# EAGLE design quadrotor (EAGLE 7.7.0)
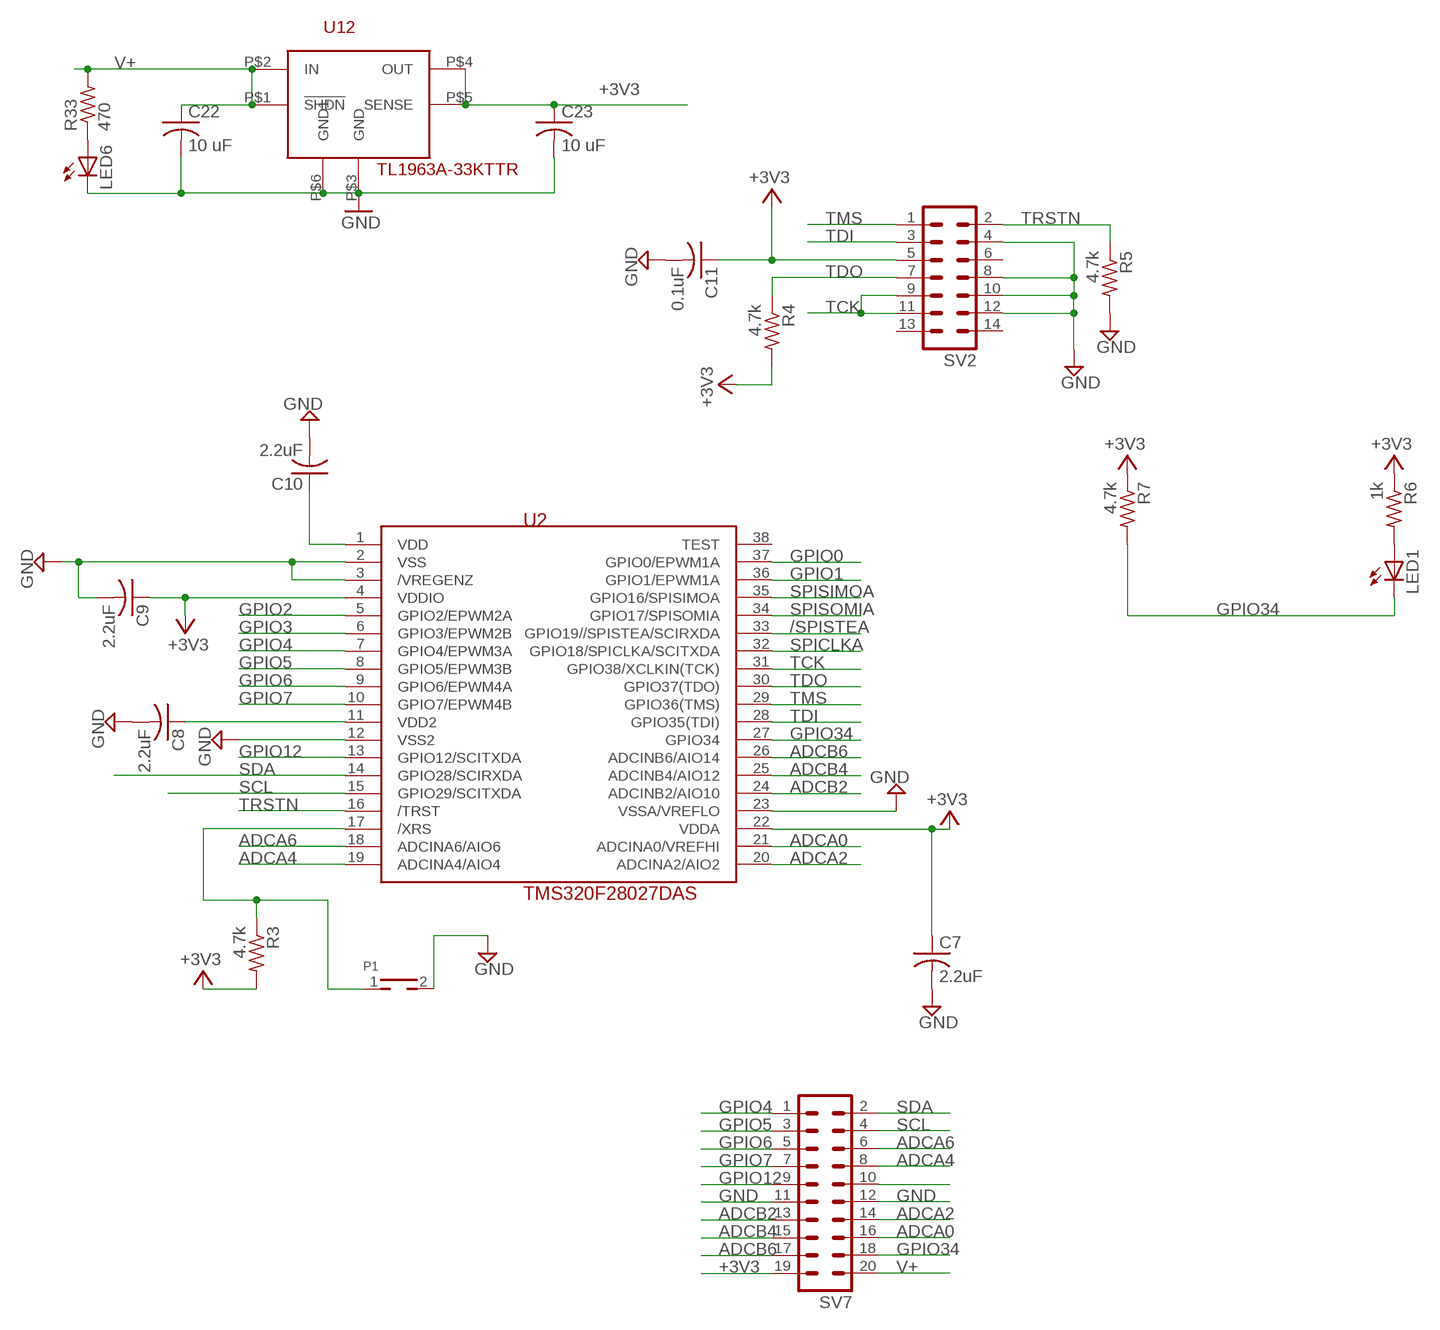
[diagram p0: schematic, sheet 1, part 1 of 2]
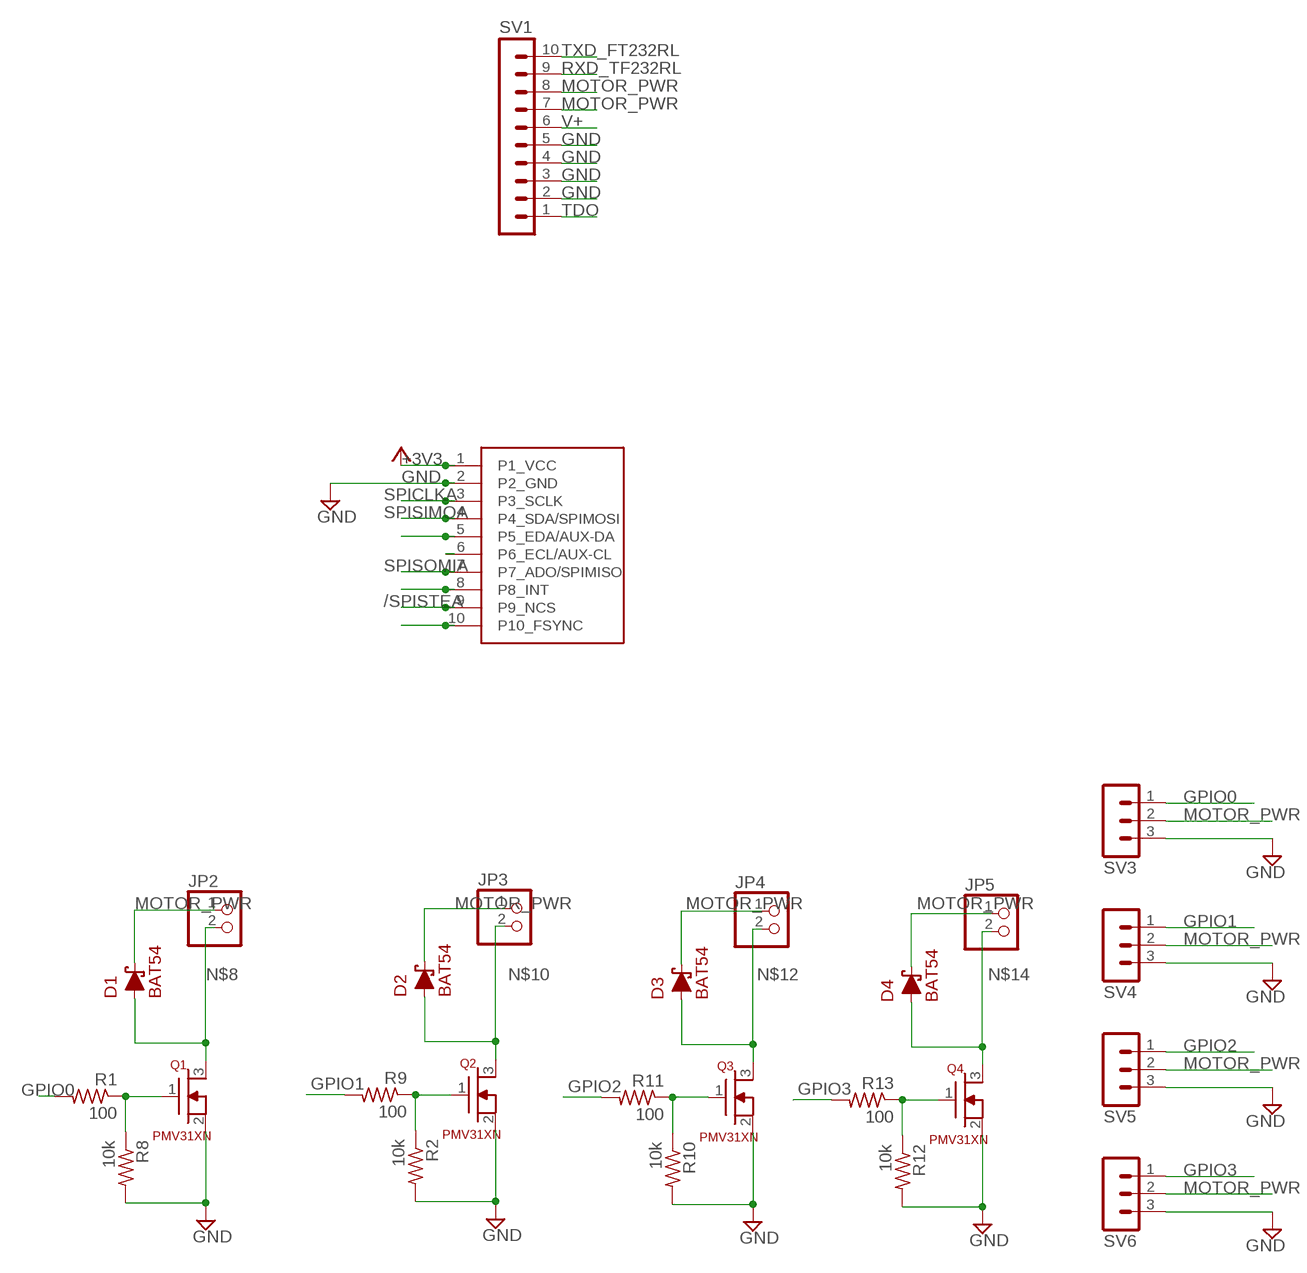
[diagram p1: schematic, sheet 1, part 2 of 2]

## Parts
C7  2.2uF  C-USC1206  [C1206]
C8  2.2uF  C-USC1206  [C1206]
C9  2.2uF  C-USC1206  [C1206]
C10  2.2uF  C-USC1206  [C1206]
C11  0.1uF  C-USC1206  [C1206]
C22  10 uF  C-USC1206  [C1206]
C23  10 uF  C-USC1206  [C1206]
D1  BAT54  [SOT23]
D2  BAT54  [SOT23]
D3  BAT54  [SOT23]
D4  BAT54  [SOT23]
JP2  PINHD-1X2  [1X02]
JP3  PINHD-1X2  [1X02]
JP4  PINHD-1X2  [1X02]
JP5  PINHD-1X2  [1X02]
LED1  LEDCHIPLED_1206  [CHIPLED_1206]
LED6  LEDCHIPLED_1206  [CHIPLED_1206]
P1  TH_PUSHBOTTON  [TH_PUSHBUTTON]
Q1  PMV31XN  [SOT23]
Q2  PMV31XN  [SOT23]
Q3  PMV31XN  [SOT23]
Q4  PMV31XN  [SOT23]
R1  100  R-US_R1206  [R1206]
R2  10k  R-US_R1206  [R1206]
R3  4.7k  R-US_R1206  [R1206]
R4  4.7k  R-US_R1206  [R1206]
R5  4.7k  R-US_R1206  [R1206]
R6  1k  R-US_R1206  [R1206]
R7  4.7k  R-US_R1206  [R1206]
R8  10k  R-US_R1206  [R1206]
R9  100  R-US_R1206  [R1206]
R10  10k  R-US_R1206  [R1206]
R11  100  R-US_R1206  [R1206]
R12  10k  R-US_R1206  [R1206]
R13  100  R-US_R1206  [R1206]
R33  470  R-US_M1206  [M1206]
SV1  MA10-1  [MA10-1]
SV2  MA07-2  [MA07-2]
SV3  MA03-1  [MA03-1]
SV4  MA03-1  [MA03-1]
SV5  MA03-1  [MA03-1]
SV6  MA03-1  [MA03-1]
SV7  MA10-2  [MA10-2]
U2  TMS320F28027DAS  [DA38]
U12  TL1963A-33KTTR  [TL1963AKTTR]
U$1  MPU-9250-BB  [MPU-9250-BB]

## Nets
+3V3 [supply]: C7.1 C9.1 C11.1 C23.1 R3.2 R4.2 R6.1 R7.1 SV2.5 SV7.19 U2.4(VDDIO) U2.22(VDDA) U12.P$4(OUT) U12.P$5(SENSE) U$1.1(P1_VCC)
/SPISTEA: U2.33(GPIO19//SPISTEA/SCIRXDA) U$1.9(P9_NCS)
ADCA0: SV7.16 U2.21(ADCINA0/VREFHI)
ADCA2: SV7.14 U2.20(ADCINA2/AIO2)
ADCA4: SV7.8 U2.19(ADCINA4/AIO4)
ADCA6: SV7.6 U2.18(ADCINA6/AIO6)
ADCB2: SV7.13 U2.24(ADCINB2/AIO10)
ADCB4: SV7.15 U2.25(ADCINB4/AIO12)
ADCB6: SV7.17 U2.26(ADCINB6/AIO14)
ASCL: U$1.6(P6_ECL/AUX-CL)
ASDA: U$1.5(P5_EDA/AUX-DA)
FSYNC: U$1.10(P10_FSYNC)
GND [supply]: C7.2 C8.2 C9.2 C10.2 C11.2 C22.2 C23.2 LED6.C P1.2 Q1.2(S) Q2.2(S) Q3.2(S) Q4.2(S) R2.2 R5.2 R8.2 R10.2 R12.2 SV1.2 SV1.3 SV1.4 SV1.5 SV2.4 SV2.8 SV2.10 SV2.12 SV3.3 SV4.3 SV5.3 SV6.3 SV7.11 SV7.12 U2.2(VSS) U2.3(/VREGENZ) U2.12(VSS2) U2.23(VSSA/VREFLO) U12.P$3(GND) U12.P$6(GND1) U$1.2(P2_GND)
GPIO0: R1.2 SV3.1 U2.37(GPIO0/EPWM1A)
GPIO1: R9.2 SV4.1 U2.36(GPIO1/EPWM1A)
GPIO2: R11.2 SV5.1 U2.5(GPIO2/EPWM2A)
GPIO3: R13.2 SV6.1 U2.6(GPIO3/EPWM2B)
GPIO4: SV7.1 U2.7(GPIO4/EPWM3A)
GPIO5: SV7.3 U2.8(GPIO5/EPWM3B)
GPIO6: SV7.5 U2.9(GPIO6/EPWM4A)
GPIO7: SV7.7 U2.10(GPIO7/EPWM4B)
GPIO12: SV7.9 U2.13(GPIO12/SCITXDA)
GPIO34: LED1.C R7.2 SV7.18 U2.27(GPIO34)
INT: U$1.8(P8_INT)
MOTOR_PWR [supply]: D1.3 D2.3 D3.3 D4.3 JP2.1 JP3.1 JP4.1 JP5.1 SV1.7 SV1.8 SV3.2 SV4.2 SV5.2 SV6.2
N$1: LED1.A R6.2
N$2: Q1.1(G) R1.1 R8.1
N$3: C8.1 U2.11(VDD2)
N$5: Q3.1(G) R10.1 R11.1
N$6: Q2.1(G) R2.1 R9.1
N$7: Q4.1(G) R12.1 R13.1
N$8 [supply]: D1.1 JP2.2 Q1.3(D)
N$10 [supply]: D2.1 JP3.2 Q2.3(D)
N$12 [supply]: D3.1 JP4.2 Q3.3(D)
N$14 [supply]: D4.1 JP5.2 Q4.3(D)
N$15: SV7.10
N$21: C10.1 U2.1(VDD)
N$35: P1.1 R3.1 U2.17(/XRS)
N$57: LED6.A R33.1
RXD_TF232RL: SV1.9
SCL: SV7.4 U2.15(GPIO29/SCITXDA)
SDA: SV7.2 U2.14(GPIO28/SCIRXDA)
SPICLKA: U2.32(GPIO18/SPICLKA/SCITXDA) U$1.3(P3_SCLK)
SPISIMOA: U2.35(GPIO16/SPISIMOA) U$1.4(P4_SDA/SPIMOSI)
SPISOMIA: U2.34(GPIO17/SPISOMIA) U$1.7(P7_ADO/SPIMISO)
TCK: SV2.9 SV2.11 U2.31(GPIO38/XCLKIN(TCK))
TDI: SV2.3 U2.28(GPIO35(TDI))
TDO: R4.1 SV1.1 SV2.7 U2.30(GPIO37(TDO))
TMS: SV2.1 U2.29(GPIO36(TMS))
TRSTN: R5.1 SV2.2 U2.16(/TRST)
TXD_FT232RL: SV1.10
V+ [supply]: C22.1 R33.2 SV1.6 SV7.20 U12.P$1(!SHDN) U12.P$2(IN)
Unconnected: SV2.6 SV2.13 SV2.14 U2.38(TEST)

## Library data of the parts
C7-C11 C22 C23 = rcl:C-US: CAPACITOR, American symbol
D1-D4 = SE423EagleLibrary:BAT54
JP2-JP5 = pinhead:PINHD-1X2: PIN HEADER
LED1 LED6 = led:LED: LED OSRAM: - CHIPLED LG R971, LG N971, LY N971, LG Q971, LY Q971, LO R971, LY R971 LH N974, LH R974 LS Q976, LO Q976, LY Q976 LO Q996 - Hyper CHIPLED LW Q18S LB Q993, LB Q99A, LB R99A - SideLED LS A670, LO A670, LY A670, LG A670, LP A670 LB A673, LV A673, LT A673, LW A673 LH A674 LY A675 LS A676, LA A676, LO A676, LY A676, LW A676 LS A679, LY A679, LG A679 - Hyper Micro SIDELED® LS Y876, LA Y876, LO Y876, LY Y876 LT Y87S - SmartLED LW L88C, LW L88S LB L89C, LB L89S, LG L890 LS L89K, LO L89K, LY L89K LS L896, LA L896, LO L896, LY L896 - TOPLED LS T670, LO T670, LY T670, LG T670, LP T670 LSG T670, LSP T670, LSY T670, LOP T670, LYG T670 LG T671, LOG T671, LSG T671 LB T673, LV T673, LT T673, LW T673 LH T674 LS T676, LA T676, LO T676, LY T676, LB T676, LH T676, LSB T676, LW T676 LB T67C, LV T67C, LT T67C, LS T67K, LO T67K, LY T67K, LW E67C LS E67B, LA E67B, LO E67B, LY E67B, LB E67C, LV E67C, LT E67C LW T67C LS T679, LY T679, LG T679 LS T770, LO T770, LY T770, LG T770, LP T770 LB T773, LV T773, LT T773, LW T773 LH T774 LS E675, LA E675, LY E675, LS T675 LS T776, LA T776, LO T776, LY T776, LB T776 LHGB T686 LT T68C, LB T68C - Hyper Mini TOPLED® LB M676 - Mini TOPLED Santana® LG M470 LS M47K, LO M47K, LY M47K Source: http://www.osram.convergy.de LUXEON: - LUMILED® LXK2-PW12-R00, LXK2-PW12-S00, LXK2-PW14-U00, LXK2-PW14-V00 LXK2-PM12-R00, LXK2-PM12-S00, LXK2-PM14-U00 LXK2-PE12-Q00, LXK2-PE12-R00, LXK2-PE12-S00, LXK2-PE14-T00, LXK2-PE14-U00 LXK2-PB12-K00, LXK2-PB12-L00, LXK2-PB12-M00, LXK2-PB14-N00, LXK2-PB14-P00, LXK2-PB14-Q00 LXK2-PR12-L00, LXK2-PR12-M00, LXK2-PR14-Q00, LXK2-PR14-R00 LXK2-PD12-Q00, LXK2-PD12-R00, LXK2-PD12-S00 LXK2-PH12-R00, LXK2-PH12-S00 LXK2-PL12-P00, LXK2-PL12-Q00, LXK2-PL12-R00 Source: www.luxeon.com KINGBRIGHT: KA-3528ASYC Source: www.kingbright.com
P1 = SE423EagleLibrary:TH_PUSHBOTTON
Q1-Q4 = SE423EagleLibrary:PMV31XN
R1-R13 R33 = rcl:R-US_: RESISTOR, American symbol
SV1 = con-lstb:MA10-1: PIN HEADER; OC_FARNELL: unknown; OC_NEWARK: unknown
SV2 = con-lstb:MA07-2: PIN HEADER; OC_FARNELL: unknown; OC_NEWARK: unknown
SV3-SV6 = con-lstb:MA03-1: PIN HEADER; OC_FARNELL: unknown; OC_NEWARK: unknown
SV7 = con-lstb:MA10-2: PIN HEADER; OC_FARNELL: unknown; OC_NEWARK: unknown
U2 = SE423EagleLibrary:TMS320F28027DAS
U12 = custom4:TL1963A-33KTTR
U$1 = MPU-9250_Breakoutboard:MPU-9250-BB

## Net classes
0 default: width 0.203 mm, drill 0.508 mm, clearance 0.203 mm
1 supply: width 0.61 mm, drill 0.508 mm, clearance 0.203 mm

## Board
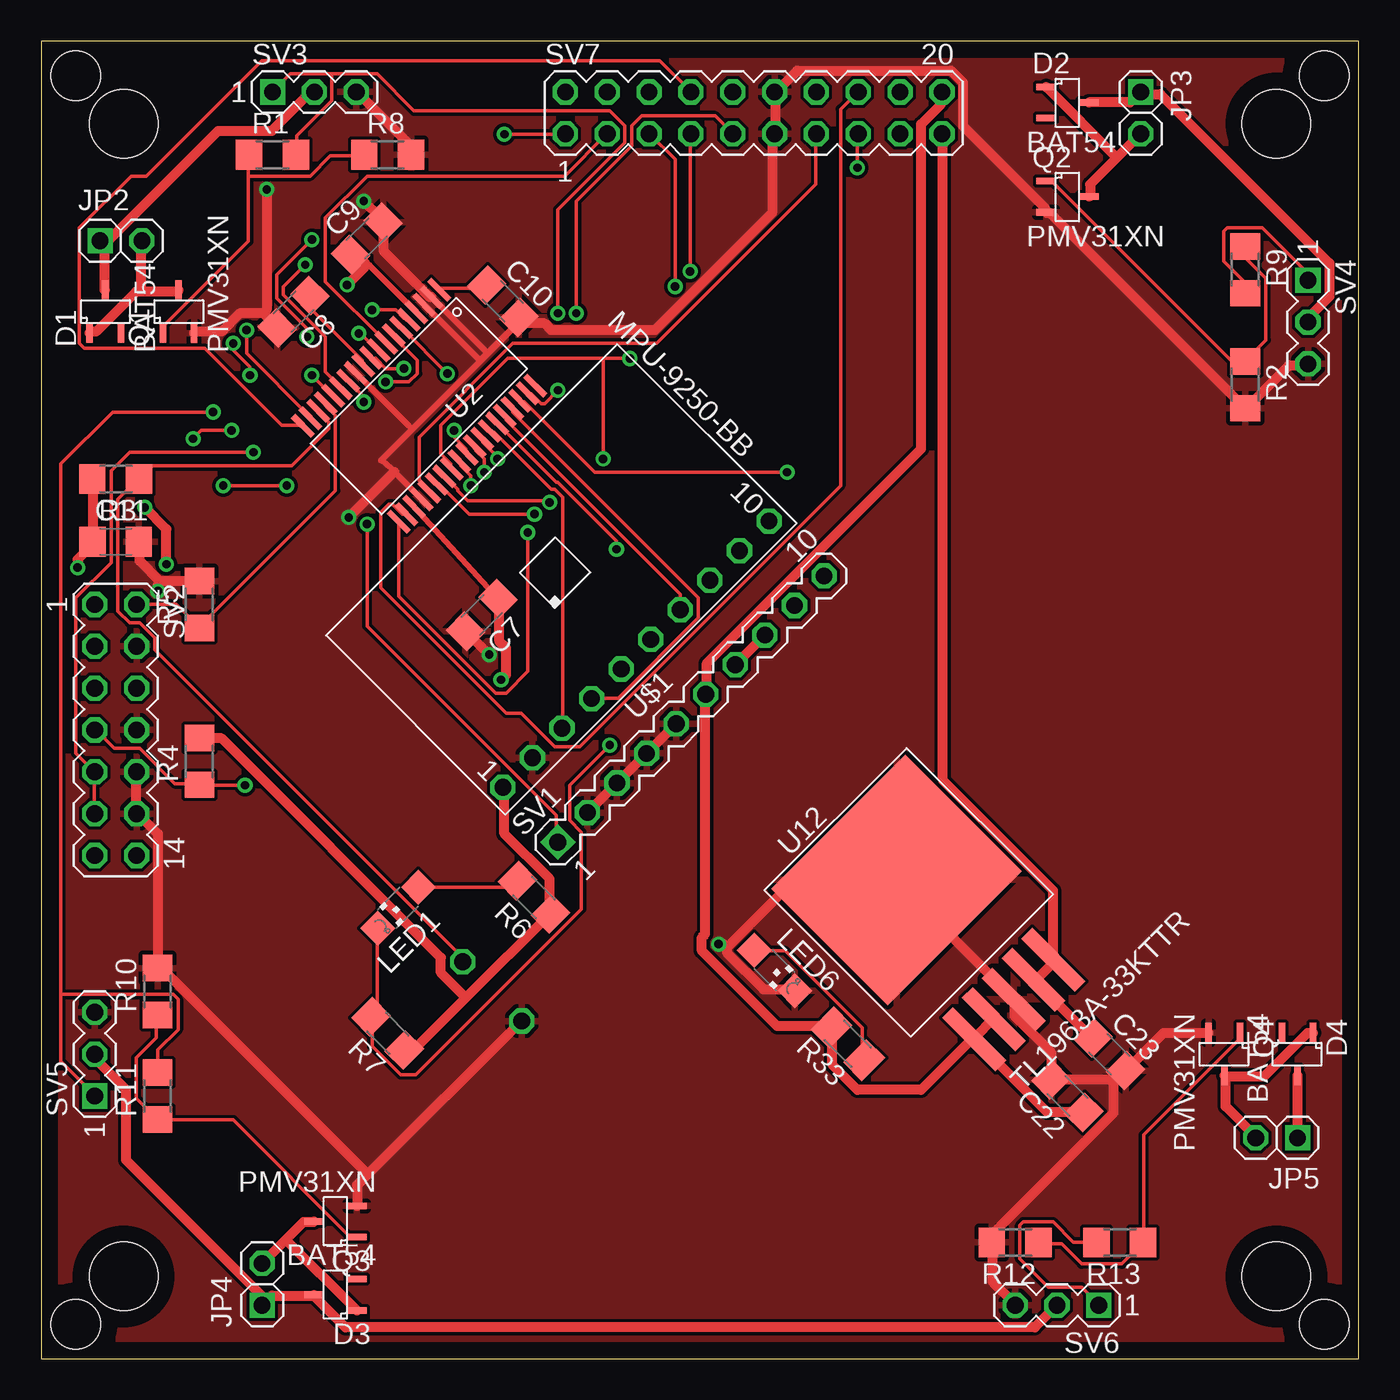
[diagram p2: board, top side]
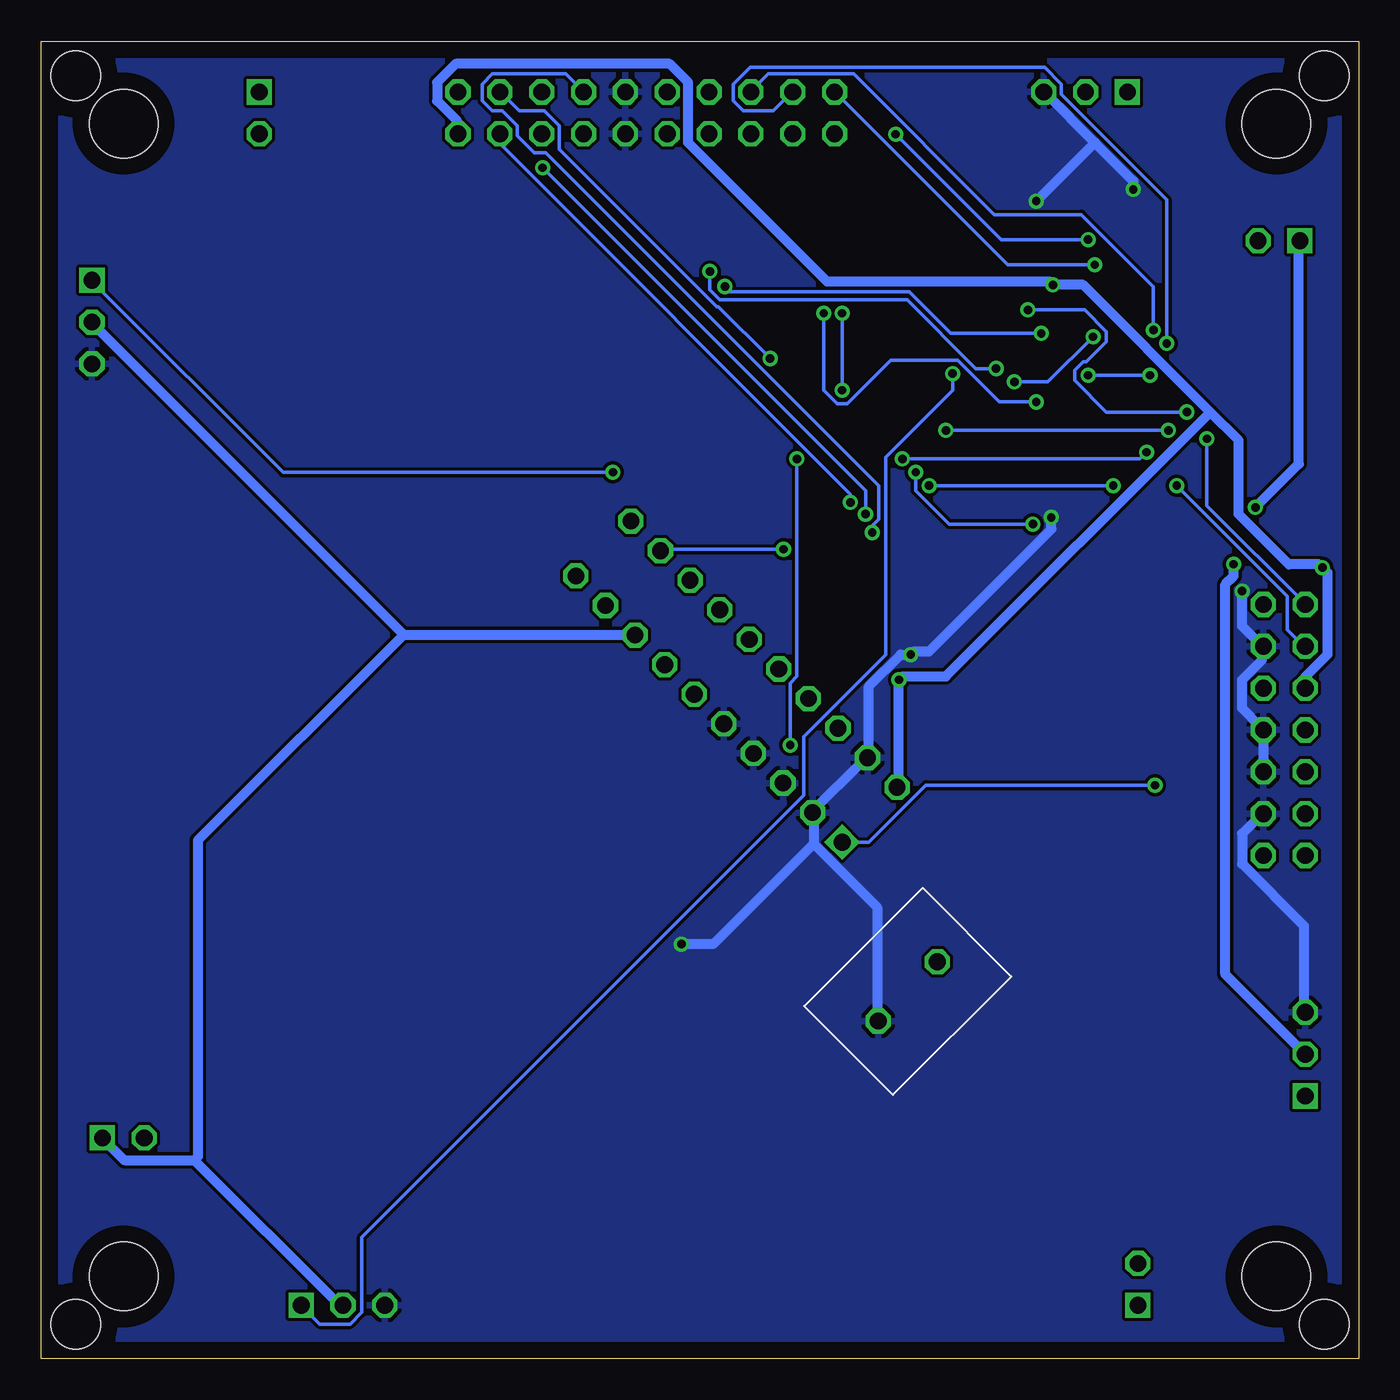
[diagram p3: board, bottom side, seen from below]

Size 80 x 80 mm. Coordinates in mm from the lower left corner, seen from the top.
Outline: 0,0 80,0 80,80 0,80 0,0
Copper layers (1*16): Top 0.035mm / dielectric 1.5mm / Bottom 0.035mm
Design rules "default *": minimum track width 8mil, minimum drill 20mil, track to track 8mil, track to pad 8mil, pad to pad 8mil, via to via 8mil, smd to smd 8mil, copper to edge 40mil, drill to drill 8mil, minimum pad ring 10mil, minimum via ring 8mil, stop-mask expansion 4mil, vias tented up to drill 0mil, thermal gap 10mil
Holes 3 mm at 2.1,77.9 77.9,77.9 77.9,2.1 2.1,2.1
Holes 4.15 mm at 5,75 75,75 75,5 5,5

### Footprints (pad centres in the part's own frame; a part is rotated, then mirrored left to right if it is on the bottom)
C1206 = smd 1.6 x 1.8: 1 -1.4,0; 2 1.4,0
SOT23 = smd 0.4 x 1.2: 1 -0.95,-1.3; 2 0.95,-1.3; 3 0,1.3
1X02 = drill 1.016 square: 1 -1.27,0 | drill 1.016 octagon: 2 1.27,0
CHIPLED_1206 = smd 1.5 x 1.5: A 0,-1.75; C 0,1.75
TH_PUSHBUTTON = drill 1.016 octagon: 1 0,2.54; 2 0,-2.54
R1206 = smd 1.6 x 1.803: 1 -1.422,0; 2 1.422,0
M1206 = smd 1.6 x 2: 1 -1.4,0; 2 1.4,0
MA10-1 = drill 1.016 square: 1 -11.43,0 | drill 1.016 octagon: 2 -8.89,0; 3 -6.35,0; 4 -3.81,0; 5 -1.27,0; 6 1.27,0; 7 3.81,0; 8 6.35,0; 9 8.89,0; 10 11.43,0
MA07-2 = drill 1.016 octagon: 1 -7.62,-1.27; 2 -7.62,1.27; 3 -5.08,-1.27; 4 -5.08,1.27; 5 -2.54,-1.27; 6 -2.54,1.27; 7 0,-1.27; 8 0,1.27; 9 2.54,-1.27; 10 2.54,1.27; 11 5.08,-1.27; 12 5.08,1.27; 13 7.62,-1.27; 14 7.62,1.27
MA03-1 = drill 1.016 square: 1 -2.54,0 | drill 1.016 octagon: 2 0,0; 3 2.54,0
MA10-2 = drill 1.016 octagon: 1 -11.43,-1.27; 2 -11.43,1.27; 3 -8.89,-1.27; 4 -8.89,1.27; 5 -6.35,-1.27; 6 -6.35,1.27; 7 -3.81,-1.27; 8 -3.81,1.27; 9 -1.27,-1.27; 10 -1.27,1.27; 11 1.27,-1.27; 12 1.27,1.27; 13 3.81,-1.27; 14 3.81,1.27; 15 6.35,-1.27; 16 6.35,1.27; 17 8.89,-1.27; 18 8.89,1.27; 19 11.43,-1.27; 20 11.43,1.27
DA38 = smd 0.35 x 1.705: 1 -5.85,-4.12; 2 -5.2,-4.12; 3 -4.55,-4.12; 4 -3.9,-4.12; 5 -3.25,-4.12; 6 -2.6,-4.12; 7 -1.95,-4.12; 8 -1.3,-4.12; 9 -0.65,-4.12; 10 0,-4.12; 11 0.65,-4.12; 12 1.3,-4.12; 13 1.95,-4.12; 14 2.6,-4.12; 15 3.25,-4.12; 16 3.9,-4.12; 17 4.55,-4.12; 18 5.2,-4.12; 19 5.85,-4.12; 20 5.85,4.12; 21 5.2,4.12; 22 4.55,4.12; 23 3.9,4.12; 24 3.25,4.12; 25 2.6,4.12; 26 1.95,4.12; 27 1.3,4.12; 28 0.65,4.12; 29 0,4.12; 30 -0.65,4.12; 31 -1.3,4.12; 32 -1.95,4.12; 33 -2.6,4.12; 34 -3.25,4.12; 35 -3.9,4.12; 36 -4.55,4.12; 37 -5.2,4.12; 38 -5.85,4.12
TL1963AKTTR = smd 0.914 x 4.572: P$1 -3.81,-10.16; P$2 -2.108,-10.16; P$3 -0.406,-10.16; P$4 1.295,-10.16; P$5 2.997,-10.16 | smd 11.5 x 10: P$6 -0.3,0
MPU-9250-BB = drill 1.016 octagon: 1 -11.434,-6.96; 2 -8.894,-6.96; 3 -6.354,-6.96; 4 -3.814,-6.96; 5 -1.274,-6.96; 6 1.266,-6.96; 7 3.806,-6.96; 8 6.346,-6.96; 9 8.886,-6.96; 10 11.426,-6.96

### Placement (x,y rotation side)
C7  26.75,45.16 225 top
C8  15.32,63.58 225 top
C9  19.77,68.03 45 top
C10  28.02,64.22 315 top
C11  4.53,49.61 0 top
C22  62.31,15.95 135 top
C23  64.85,18.5 315 top
D1  3.89,63.58 0 top
D2  62.31,76.28 270 top
D3  17.86,3.89 90 top
D4  76.28,18.5 180 top
JP2  4.85,67.89 0 top
JP3  66.75,75.64 270 top
JP4  13.41,4.53 90 top
JP5  75.01,13.41 180 top
LED1  21.67,27.38 135 top
LED6  44.53,23.57 225 top
P1  27.38,22.3 315 bottom
Q1  8.34,63.58 0 top
Q2  62.31,70.56 270 top
Q3  17.86,8.34 90 top
Q4  71.83,18.5 180 top
R1  14.05,73.11 0 top
R2  73.11,59.14 270 top
R3  4.53,53.42 180 top
R4  9.61,36.27 90 top
R5  9.61,45.8 90 top
R6  29.92,28.02 135 top
R7  21.04,19.77 135 top
R8  21.04,73.11 0 top
R9  73.11,66.12 270 top
R10  7.06,22.3 90 top
R11  7.06,15.95 90 top
R12  59.14,7.06 180 top
R13  65.48,7.06 180 top
R33  48.98,19.13 135 top
SV1  39.45,39.45 45 top
SV2  4.53,38.18 270 top
SV3  16.59,76.92 0 top
SV4  76.92,62.94 270 top
SV5  3.26,18.5 90 top
SV6  61.67,3.26 180 top
SV7  43.26,75.64 0 top
U2  22.94,57.87 225 top
U12  52.15,29.29 45 top
U$1  31.2,47.7 45 top

### Tracks (layer width: path | path; a pad name or v marks a point on that pad's centre or on a via)
+3V3  (via drill 0.51)
  Top 0.356: U2.22 C7.1 | U2.4 19.92,66.4 19.66,66.55 C9.1
  Top 0.61: C23.1 63.78,19.49 60.33,22.94 U12.P$4 60.53,23.14 61.34,23.96 U12.P$5 61.45,24.26 61.45,28.43 54.74,35.13 54.74,74.35 SV7.19 | R3.2 3.13,53.42 3.13,49.66 C11.1 3.03,49.36 2.21,48.54 v2.21,48.03 | v18.57,65.21 19.59,66.22 19.59,66.42 19.66,66.55 | 25.79,21.92 30.87,27 R6.1 30.87,27.31 30.87,29.14 28.12,31.88 28.12,34.62 U$1.1 | 25.79,21.92 22.64,18.77 22.13,18.77 R7.1 | 25.79,21.92 24.26,23.45 24.26,24.36 10.95,37.67 9.63,37.67 R4.2 | v27.92,41.23 28.22,41.53 28.22,43.16 27.82,43.56 27.82,46 C7.1
  Bottom 0.61: SV2.5 3.23,40.72 3.23,41.43 1.91,42.75 1.91,47.73 v2.21,48.03 2.42,48.24 4.25,48.24 7.29,51.29 7.29,55.76 9.02,57.48 | 9.02,57.48 16.74,65.21 v18.57,65.21 18.77,65.41 32.29,65.41 40.72,73.84 40.72,77.5 41.84,78.62 54.84,78.62 55.96,77.5 55.96,76.38 54.74,75.16 54.74,74.45 SV7.19 | U$1.1 28.02,34.73 27.92,34.83 v27.92,41.23 27.72,41.43 25.07,41.43 9.02,57.48
/SPISTEA  (via drill 0.51)
  Top 0.203: v34.93,49.15 34.93,49.66 31.37,53.22 31.27,53.22 27.72,56.77 U2.33
  Bottom 0.203: v34.93,49.15 42.35,49.15 U$1.9
ADCA0
  Top 0.203: U2.21 22.13,51.29 21.92,51.29 21.31,51.9 21.11,51.9 20.6,51.39 20.6,46.82 28.22,39.2 29.14,39.2 31.17,37.16 32.69,37.16 48.54,53.01 48.54,75.87 49.56,76.89 SV7.16
ADCA2  (via drill 0.51)
  Top 0.203: v29.54,50.17 29.54,41.74 28.22,40.41 27.61,40.41 21.72,46.31 21.72,50.78 U2.20
  Bottom 0.203: v29.54,50.17 29.54,50.58 29.14,50.98 29.14,53.01 49.36,73.23 50.07,73.23 51.08,74.25 51.08,74.86 52,75.77 52.61,75.77 53.22,76.38 53.22,77.4 52.61,78.01 48.14,78.01 47.12,76.99 SV7.14
ADCA4
  Top 0.203: U2.19 15.83,56.67 14.61,56.67 9.94,61.34 2.62,61.34 2.32,61.65 2.32,68.66 5.46,71.81 6.38,71.81 13.39,78.82 37.57,78.82 39.4,76.99 SV7.8
ADCA6  (via drill 0.51)
  Top 0.203: v12.48,62.46 12.48,61.04 16.34,57.18 U2.18
  Bottom 0.203: v12.48,62.46 12.48,65.1 16.84,69.47 22.13,69.47 30.66,78.01 35.84,78.01 36.86,76.99 SV7.6
ADCB2
  Top 0.203: U2.24 23.55,52.71 22.94,53.32 22.94,55.96 28.63,61.65 37.37,61.65 47.02,71.3 47.02,74.35 SV7.13
ADCB4  (via drill 0.51)
  Top 0.203: v29.95,51.29 25.99,51.29 24.26,53.01 24.06,53.01 U2.25 | v49.56,72.32 49.56,74.35 SV7.15
  Bottom 0.203: v29.95,51.29 29.95,52.71 v49.56,72.32
ADCB6  (via drill 0.51)
  Top 0.203: v30.87,52 30.76,52.1 25.89,52.1 25.28,52.71 25.28,52.81 24.57,53.52 U2.26
  Bottom 0.203: v30.87,52 30.87,52.51 52.1,73.74 52.1,74.35 SV7.17
GND  (via drill 0.51)
  Top 0.356: 27.16,61.12 29.01,62.97 C10.2 29.01,62.92 22.5,56.4 | 27.16,61.12 27.04,61.12 U2.2 | 27.16,61.12 26.73,60.68 26.55,60.68 U2.3 | 22.5,56.4 20.63,54.54 20.75,54.54 21.44,53.85 U2.23 | U2.12 22.5,56.47 22.5,56.4
  Top 0.61: 13.49,63.48 12.07,63.48 10.95,62.36 9.33,62.36 Q1.2 | 13.49,63.48 14.3,62.67 C8.2 | R8.2 22.43,73.13 22.43,73.64 19.18,76.89 SV3.3 | v13.69,71 13.69,63.68 13.49,63.48 | SV4.3 76.89,60.33 75.77,60.33 73.33,57.89 R2.2 73.03,57.79 61.24,69.57 61.04,69.57 Q2.2 60.94,69.88 55.96,74.86 55.96,77.5 55.25,78.21 45.9,78.21 44.78,77.09 SV7.12 44.58,76.89 44.58,74.45 SV7.11 44.38,74.15 44.38,69.57 37.27,62.46 30.97,62.46 30.56,62.87 29.14,62.87 C10.2 | U2.2 23.55,64.49 20.81,67.24 20.81,68.97 C9.2 20.6,69.27 v19.59,70.29 | 41.63,24.97 41.63,24.67 43.87,22.43 45.7,22.43 LED6.C | 41.63,24.97 45.7,29.04 51.9,29.04 U12.P$6 52.1,28.83 58.91,22.03 U12.P$3 59.11,21.72 59.11,20.81 61.34,18.57 61.34,17.25 C22.2 61.34,16.95 65.1,16.95 | SV6.3 59.11,3.33 57.79,4.65 57.79,6.99 R12.2 57.89,7.29 57.89,7.7 65.1,14.91 65.1,16.95 | Q4.2 70.79,19.79 68.15,19.79 65.92,17.55 C23.2 65.61,17.35 65.21,16.95 65.1,16.95 | 7.19,47.22 5.97,48.44 5.97,49.56 C11.2 | 7.19,47.22 9.53,47.22 R5.2 | SV2.10 5.77,35.64 5.77,33.3 SV2.12 5.87,33.1 7.09,31.88 7.09,23.75 R10.2 7.39,23.65 19.84,11.2 | v7.09,46.61 7.09,47.02 7.19,47.22 | 19.84,11.2 29.14,20.5 P1.2 | 19.84,11.2 19.18,10.54 19.18,9.33 Q3.2 | v27.21,42.75 25.79,44.17 C7.2 | SV1.2 SV1.3 SV1.4 SV1.5 | v41.13,25.18 41.43,25.18 41.63,24.97 | v18.67,51.08 21.31,53.73 21.44,53.85
  Bottom 0.61: v13.69,71 13.69,71.5 16.03,73.84 | 16.03,73.84 19.08,76.89 SV3.3 | v19.59,70.29 16.03,73.84 | SV5.3 3.33,21.11 3.33,26.29 7.09,30.05 7.09,31.88 5.87,33.1 SV2.12 | SV2.10 5.77,35.64 5.77,38.18 SV2.8 5.97,38.38 7.09,39.5 7.09,41.23 5.87,42.45 5.87,43.26 SV2.4 6.07,43.46 7.09,44.48 v7.09,46.61 | 33.1,31.27 29.24,27.41 29.24,20.6 P1.2 | 33.1,31.27 33.1,32.9 SV1.2 33.2,33.2 30.05,36.35 U$1.2 29.75,36.55 29.75,40.82 27.82,42.75 v27.21,42.75 27,42.95 26.09,42.95 18.67,50.37 v18.67,51.08 | v41.13,25.18 39.2,25.18 33.1,31.27
  pour Top: 0,80 80,80 80,0 0,0
  pour Bottom: 0,80 80,80 80,0 0,0
GPIO0  (via drill 0.51)
  Top 0.203: v31.37,58.8 30.56,57.99 30.36,57.99 29.75,58.6 29.54,58.6 U2.37 | v31.37,63.48 31.37,69.78 35.44,73.84 35.44,74.86 34.52,75.77 22.64,75.77 20.4,78.01 17.66,78.01 | 17.66,78.01 15.12,78.01 14.1,76.99 SV3.1 | 17.66,78.01 17.66,76.38 15.52,74.25 15.52,73.13 R1.2
  Bottom 0.203: v31.37,63.48 v31.37,58.8
GPIO1  (via drill 0.51)
  Top 0.203: v45.29,53.83 33.61,53.83 29.34,58.09 29.14,58.09 U2.36 | R9.2 73.03,64.8 73.03,65.41 71.81,66.63 71.81,68.46 72.01,68.66 74.15,68.66 76.89,65.92 76.89,65.51 SV4.1
  Bottom 0.203: v45.29,53.83 65.31,53.83 76.89,65.41 SV4.1
GPIO2  (via drill 0.51)
  Top 0.203: v20.09,63.68 21.52,63.68 22.03,63.17 22.23,63.17 U2.5 | v10.44,57.48 4.35,57.48 1.2,54.33 1.2,22.13 | 1.2,22.13 1.2,18.06 3.23,16.03 SV5.1 | 1.2,22.13 8.01,22.13 8.31,21.82 8.31,19.99 7.09,18.77 7.09,17.45 R11.2
  Bottom 0.203: v20.09,63.68 16.64,63.68 15.32,62.36 15.32,61.75 16.54,60.53 16.74,60.53 17.25,60.02 17.25,59.41 15.32,57.48 v10.44,57.48
GPIO3  (via drill 0.51)
  Top 0.203: v24.67,59.82 21.92,62.56 U2.6 | R13.2 63.99,7.09 62.67,7.09 61.45,8.31 59.62,8.31 59.41,8.11 59.41,6.07 61.14,4.35 63.17,4.35 64.19,3.33 SV6.1
  Bottom 0.203: v24.67,59.82 24.67,58.8 28.73,54.74 28.73,42.75 33.71,37.77 33.71,34.22 60.53,7.39 60.53,2.82 61.24,2.11 63.07,2.11 SV6.1
GPIO4  (via drill 0.51)
  Top 0.203: v20.91,59.31 22.33,59.31 22.84,59.82 22.84,60.63 21.42,62.06 U2.7 | v16.13,62.06 16.13,62.56 14.3,64.39 14.3,65.81 v16.44,67.95 | v28.12,74.35 31.78,74.35 SV7.1
  Bottom 0.203: v20.91,59.31 18.88,59.31 v16.13,62.06 | v16.44,67.95 21.72,67.95 v28.12,74.35
GPIO5
  Top 0.203: U2.8 20.91,61.75 17.25,65.41 17.25,69.27 19.79,71.81 31.78,71.81 34.32,74.35 SV7.3
GPIO6  (via drill 0.51)
  Top 0.203: v19.28,62.26 19.38,62.26 20.4,61.24 U2.9 | v38.48,65.1 38.48,72.83 36.96,74.35 SV7.5
  Bottom 0.203: v19.28,62.26 24.77,62.26 27.31,64.8 38.18,64.8 v38.48,65.1
GPIO7  (via drill 0.51)
  Top 0.203: v22.03,60.13 20.91,60.13 20.3,60.73 20.09,60.73 U2.10 | v39.4,66.02 39.4,74.35 SV7.7
  Bottom 0.203: v22.03,60.13 23.25,60.13 27.41,64.29 38.79,64.29 39.4,64.9 v39.4,66.02
GPIO12  (via drill 0.51)
  Top 0.203: v19.59,58.09 19.59,58.4 18.67,59.31 U2.13 | v32.49,63.48 32.49,70.29 35.84,73.64 35.84,74.86 36.45,75.47 40.92,75.47 41.94,74.45 SV7.9
  Bottom 0.203: v19.59,58.09 21.82,58.09 24.36,60.63 28.43,60.63 31.07,57.99 31.68,57.99 32.49,58.8 v32.49,63.48
GPIO34  (via drill 0.51)
  Top 0.203: LED1.C 20.4,26.09 20.4,21.11 20.09,20.81 R7.2 20.09,20.7 20.09,18.98 21.82,17.25 22.74,17.25 32.8,27.31 32.8,31.98 32.08,32.69 32.08,34.83 v34.52,37.27 | v35.74,60.73 34.12,60.73 | 34.12,60.73 28.33,60.73 24.26,56.67 24.26,54.94 24.87,54.33 24.87,54.13 U2.27 | 34.12,60.73 v34.12,54.64
  Bottom 0.203: v35.74,60.73 38.89,63.89 38.99,63.89 48.54,73.44 48.54,74.86 49.46,75.77 50.98,75.77 52.1,76.89 SV7.18 | v34.52,37.27 34.52,41.02 34.12,41.43 v34.12,54.64
MOTOR_PWR  (via drill 0.51)
  Top 0.61: D1.3 3.84,64.9 3.84,67.64 3.64,67.85 JP2.1 4.04,67.85 10.75,74.55 14,74.55 16.34,76.89 16.54,76.89 SV3.2 | 16.54,3.84 14,3.84 JP4.1 13.49,3.74 5.16,12.07 5.16,16.34 3.33,18.16 3.33,18.47 SV5.2 | 16.54,3.84 D3.3 | v6.28,51.69 7.6,50.37 v7.6,48.24 | JP5.1 D4.3 | SV1.8 SV1.7 | D2.3 66.12,76.28 JP3.1 67.03,76.79 67.95,76.79 78.21,66.53 78.21,64.49 76.99,63.28 76.99,62.97 SV4.2 | 16.54,3.84 18.47,1.91 60.33,1.91 SV6.2
  Bottom 0.61: v6.28,51.69 3.64,54.33 3.64,67.85 JP2.1 | v7.6,48.24 7.6,47.53 8.11,47.02 8.11,23.35 SV5.2 | 70.69,12.07 61.95,3.33 61.75,3.33 SV6.2 | 70.69,12.07 74.96,12.07 76.28,13.39 JP5.1 | 57.99,43.97 43.97,43.97 SV1.8 | 57.99,43.97 76.89,62.87 SV4.2 | 57.99,43.97 70.49,31.47 70.49,12.27 70.69,12.07
N$1
  Top 0.203: LED1.A 22.94,28.63 28.53,28.63 28.83,28.93 R6.2
N$2
  Top 0.203: 12.58,71.81 12.58,73.03 R1.1 | 12.58,71.81 12.58,67.85 7.39,62.67 7.39,62.36 Q1.1 | 12.58,71.81 16.34,71.81 17.55,73.03 19.59,73.03 R8.1
N$3
  Top 0.203: U2.11 19.49,60.33 19.49,60.63 16.34,63.78 16.34,64.49 C8.1
N$5
  Top 0.203: Q3.1 19.08,7.39 18.77,7.39 11.66,14.51 7.09,14.51 R11.1 6.99,14.61 5.77,15.83 5.77,18.27 6.99,19.49 6.99,20.81 R10.1
N$6
  Top 0.203: Q2.1 61.04,71.5 61.34,71.5 72.22,60.63 73.03,60.63 R2.1 73.13,60.63 74.35,61.85 74.35,65.61 73.13,66.83 73.13,67.44 R9.1
N$7
  Top 0.203: Q4.1 72.72,19.79 72.72,19.38 66.93,13.59 66.93,7.09 R13.1 66.83,6.99 65.61,5.77 63.17,5.77 61.95,6.99 60.63,6.99 R12.1
N$8
  Top 0.61: 6.07,64.8 8.31,64.8 Q1.3 | 6.07,64.8 5.77,64.8 3.33,62.36 3.03,62.36 D1.1 | 6.07,64.8 6.07,67.85 JP2.2
N$10
  Top 0.61: JP3.2 65.31,72.93 | 65.31,72.93 63.68,71.3 63.68,70.59 Q2.3 | 65.31,72.93 61.04,77.19 D2.1
N$12
  Top 0.61: JP4.2 14.86,7.24 | 14.86,7.24 15.93,8.31 16.54,8.31 Q3.3 | 14.86,7.24 19.08,3.03 D3.1
N$14
  Top 0.61: 71.91,17.15 71.91,15.32 73.74,13.49 JP5.2 | 71.91,17.15 Q4.3 | 71.91,17.15 74.25,17.15 76.89,19.79 77.19,19.79 D4.1
N$21
  Top 0.203: U2.1 24.26,65 26.9,65 27,65.1 C10.1
N$35
  Top 0.203: U2.17 16.84,57.48 17.45,56.87 17.45,56.47 15.22,54.23 6.79,54.23 5.97,53.42 R3.1 5.87,53.42 4.65,52.2 4.65,45.39 5.36,44.68 5.97,44.68 6.89,43.77 6.89,43.06 25.58,24.36 25.58,24.16 P1.1
N$57
  Top 0.203: LED6.A 43.36,24.77 45.19,24.77 49.86,20.09 49.86,18.16 R33.1
SCL  (via drill 0.51)
  Top 0.203: v16.44,59.72 17.66,58.5 U2.15 | v12.68,59.72 12.68,60.23 11.66,61.24 v11.66,61.65
  Bottom 0.203: v12.68,59.72 v16.44,59.72 | v11.66,61.65 11.66,70.39 18.06,76.79 18.06,77.4 19.08,78.41 36.96,78.41 37.98,77.4 37.98,76.38 37.37,75.77 35.54,75.77 34.42,76.89 SV7.4
SDA  (via drill 0.51)
  Top 0.203: v16.03,66.42 14.71,65.1 14.71,64.6 17.25,62.06 17.25,59.92 18.16,59.01 U2.14
  Bottom 0.203: v16.03,66.42 21.31,66.42 31.78,76.89 SV7.2
SPICLKA
  Top 0.203: U2.32 27.31,56.27 27.51,56.27 30.97,52.81 31.17,52.81 31.68,52.3 31.68,38.38 U$1.3
SPISIMOA
  Top 0.203: U2.35 28.63,57.69 28.63,57.48 39.91,46.21 39.91,44.99 35.03,40.11 33.51,40.11 U$1.4
SPISOMIA
  Top 0.203: U2.34 28.22,57.18 28.22,56.98 38.79,46.41 38.79,45.49 U$1.7
TCK  (via drill 0.51)
  Top 0.203: v27.72,54.64 27.72,54.74 26.8,55.66 26.8,55.86 U2.31 | v12.88,55.05 5.36,55.05 4.25,53.93 4.25,48.34 2.11,46.21 2.11,36.76 3.23,35.64 | 3.23,35.64 3.23,33.1 SV2.11 | 3.23,35.64 SV2.9
  Bottom 0.203: v27.72,54.64 13.29,54.64 v12.88,55.05
TDI  (via drill 0.51)
  Top 0.203: v26.09,53.01 26.09,53.62 25.48,54.23 25.48,54.44 U2.28 | v11.05,53.01 v14.91,53.01
  Bottom 0.203: v14.91,53.01 v26.09,53.01 | v11.05,53.01 4.35,46.31 4.35,44.28 3.33,43.26 SV2.3
TDO  (via drill 0.51)
  Top 0.203: SV2.7 3.33,38.18 4.45,37.06 5.97,37.06 8.11,34.93 9.53,34.93 R4.1 9.63,34.83 v12.37,34.83 | v26.9,53.83 26.9,54.64 26.39,55.15 26.39,55.35 U2.30 | v19.79,50.68 19.79,44.48 31.27,33 31.27,31.37 SV1.1
  Bottom 0.203: v26.9,53.83 26.9,52.71 24.87,50.68 v19.79,50.68 | v12.37,34.83 26.29,34.83 29.75,31.37 31.27,31.37 SV1.1
TMS  (via drill 0.51)
  Top 0.203: v25.07,56.37 25.07,55.96 25.79,55.25 25.79,55.05 U2.29 | v11.56,56.37 9.73,56.37 v9.22,55.86
  Bottom 0.203: v11.56,56.37 v25.07,56.37 | v9.22,55.86 9.22,51.79 3.23,45.8 SV2.1
TRSTN
  Top 0.203: U2.16 17.35,57.99 17.35,57.79 17.86,57.28 17.86,52.71 9.63,44.48 R5.1 9.53,44.48 8.21,45.8 SV2.2
V+
  Top 0.61: C22.1 63.28,15.02 61.04,15.02 56.67,19.38 U12.P$1 | U12.P$1 56.37,19.28 53.42,16.34 49.56,16.34 48.03,17.86 48.03,20.09 R33.2 47.73,20.2 44.68,20.2 40.11,24.77 40.11,25.58 40.31,25.79 40.31,40.31 SV1.6 40.41,40.62 40.41,42.24 53.42,55.25 53.42,74.96 54.64,76.18 54.64,76.89 SV7.20 | U12.P$2 57.79,20.6 56.77,19.59 U12.P$1